# EAGLE design SOIC+TSSOP-8 300mil DIP (EAGLE 6.2)
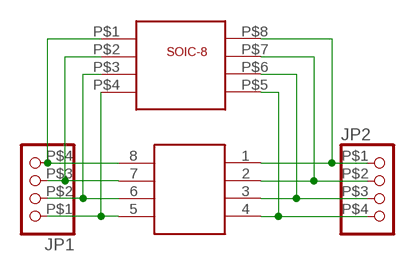
[diagram p0: schematic, sheet 1]

## Parts
JP1  PINHD-1X4THIN  [HEADER1X4]
JP2  PINHD-1X4THIN  [HEADER1X4]
U$1  SO-8  [SO-08NMW]
U$2  TSSOP-8  [TSSOP-8NM]

## Nets
N$1: JP1.P$4 U$1.P$1 U$2.8
N$2: JP1.P$3 U$1.P$2 U$2.7
N$3: JP1.P$2 U$1.P$3 U$2.6
N$4: JP1.P$1 U$1.P$4 U$2.5
N$5: JP2.P$4 U$1.P$5 U$2.4
N$6: JP2.P$3 U$1.P$6 U$2.3
N$7: JP2.P$2 U$1.P$7 U$2.2
N$8: JP2.P$1 U$1.P$8 U$2.1

## Library data of the parts
JP1 JP2 = boogie:PINHD-1X4: PIN HEADER
U$1 = boogie:SO-8
U$2 = boogie:TSSOP-8

## Board
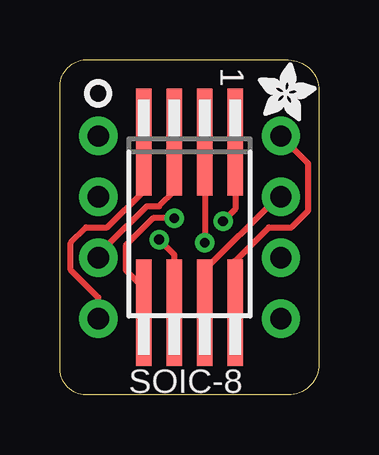
[diagram p1: board, top side]
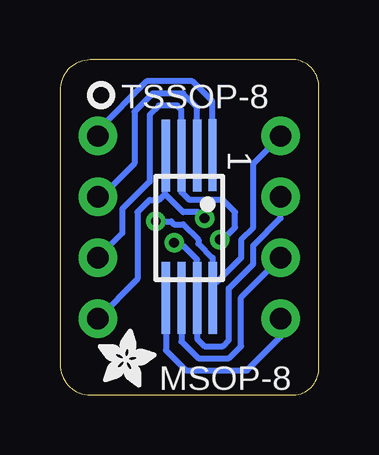
[diagram p2: board, bottom side, seen from below]

Size 10.81 x 13.97 mm. Coordinates in mm from the lower left corner, seen from the top.
Outline: 0.01,1.27 0.01,12.7 arc-90 0.96,13.97 9.54,13.97 arc-90 10.8,12.7 10.8,1.27 arc-90 9.54,0 0.96,0 arc-90 0.01,1.27
Copper layers (1*16): Top 0.035mm / dielectric 1.5mm / Bottom 0.035mm
Design rules: minimum track width 10mil, minimum drill 16mil, track to track 8mil, track to pad 8mil, pad to pad 8mil, via to via 8mil, smd to smd 8mil, copper to edge 10mil, drill to drill 8mil, minimum pad ring 14mil, minimum via ring 8mil, stop-mask expansion 4mil, vias tented up to drill 20mil, thermal gap 10mil

### Footprints (pad centres in the part's own frame; a part is rotated, then mirrored left to right if it is on the bottom)
HEADER1X4 = drill 0.889: P$1 3.81,0; P$2 1.27,0; P$3 -1.27,0; P$4 -3.81,0
SO-08NMW = smd 0.635 x 4.445: P$1 1.905,3.556; P$2 0.635,3.556; P$3 -0.635,3.556; P$4 -1.905,3.556; P$5 -1.905,-3.556; P$6 -0.635,-3.556; P$7 0.635,-3.556; P$8 1.905,-3.556
TSSOP-8NM = smd 0.35 x 3: 1 -0.965,-3.024; 2 -0.325,-3; 3 0.325,-3; 4 0.975,-3; 5 0.975,2.95; 6 0.325,2.95; 7 -0.325,2.95; 8 -0.975,2.95

### Placement (x,y rotation side)
JP1  1.6,6.99 270 top
JP2  9.22,6.99 90 top
U$1  5.41,6.99 0 top
U$2  5.41,6.99 180 bottom
U$3  [ADAFRUIT_2.5MM]  8.27,11.43 0 top
U$4  [ADAFRUIT_2.5MM]  9.22,0.32 0 bottom

### Tracks (layer width: path | path; a pad name or v marks a point on that pad's centre or on a via)
N$1  (via drill 0.41)
  Top 0.254: U$1.P$1 7.31,7.75 v6.8,7.24
  Bottom 0.254: U$2.8 4.43,4.7 | JP1.P$4 2.74,9.65 2.74,6.99 3.25,6.48 3.25,5.71 4.26,4.7 4.43,4.7 | 4.43,4.7 4.43,5.71 5.03,6.31 5.03,6.48 5.66,7.11 6.04,7.11 6.17,7.24 v6.8,7.24
N$2  (via drill 0.41)
  Top 0.254: U$1.P$2 v6.04,6.35
  Bottom 0.254: JP1.P$3 1.6,7.37 2.74,6.22 2.74,5.46 3.76,4.45 3.76,2.29 4.01,2.03 4.77,2.03 5.08,2.34 U$2.7 5.08,5.64 5.66,6.22 5.92,6.22 v6.04,6.35
N$3
  Top 0.254: JP1.P$2 1.98,6.1 1.98,6.22 3.63,7.87 4.14,7.87 4.77,8.51 U$1.P$3
  Bottom 0.254: U$2.6 5.73,2.23 5.03,1.52 3.76,1.52 3.25,2.03 3.25,4.06 JP1.P$2
N$4
  Top 0.254: JP1.P$1 1.6,4.06 0.45,5.21 0.45,6.35 1.09,6.99 1.98,6.99 3.5,8.51 U$1.P$4
  Bottom 0.254: U$2.5 6.38,1.86 5.53,1.02 2.99,1.02 1.6,2.41 JP1.P$1
N$5  (via drill 0.41)
  Top 0.254: v4.77,7.37 3.88,7.37 2.74,6.22 2.74,5.21 3.5,4.45 U$1.P$5
  Bottom 0.254: JP2.P$4 7.57,4.83 7.57,7.62 7.06,8.13 6.68,8.13 6.42,8.38 | 6.42,8.38 6.42,9.94 U$2.4 | v4.77,7.37 5.03,7.62 5.66,7.62 6.42,8.38
N$6  (via drill 0.41)
  Top 0.254: U$1.P$6 4.77,5.84 v4.14,6.48
  Bottom 0.254: v4.14,6.48 4.01,6.48 3.5,6.99 3.5,7.62 4.01,8.13 5.41,8.13 5.73,8.45 U$2.3 5.73,11.88 5.92,12.07 6.68,12.07 7.06,11.68 7.06,8.89 8.2,7.75 8.2,6.73 JP2.P$3
N$7
  Top 0.254: JP2.P$2 9.09,8.26 5.92,5.08 5.92,4.7 6.04,4.57 U$1.P$7
  Bottom 0.254: U$2.2 5.08,11.99 5.66,12.57 6.93,12.57 7.69,11.81 7.69,9.65 9.09,8.26 JP2.P$2
N$8
  Top 0.254: U$1.P$8 7.31,5.59 8.71,6.99 9.66,6.99 10.36,7.68 10.36,9.65 JP2.P$1
  Bottom 0.254: U$2.1 4.44,12.24 5.28,13.08 7.19,13.08 9.22,11.05 JP2.P$1

### Text on the board
tPlace: 1 | SOIC-8
bPlace: TSSOP-8 | 1 | MSOP-8